# Altium schematic sheet Offset.SchDoc
size A4; SheetNumber: 5; SheetTotal: 7
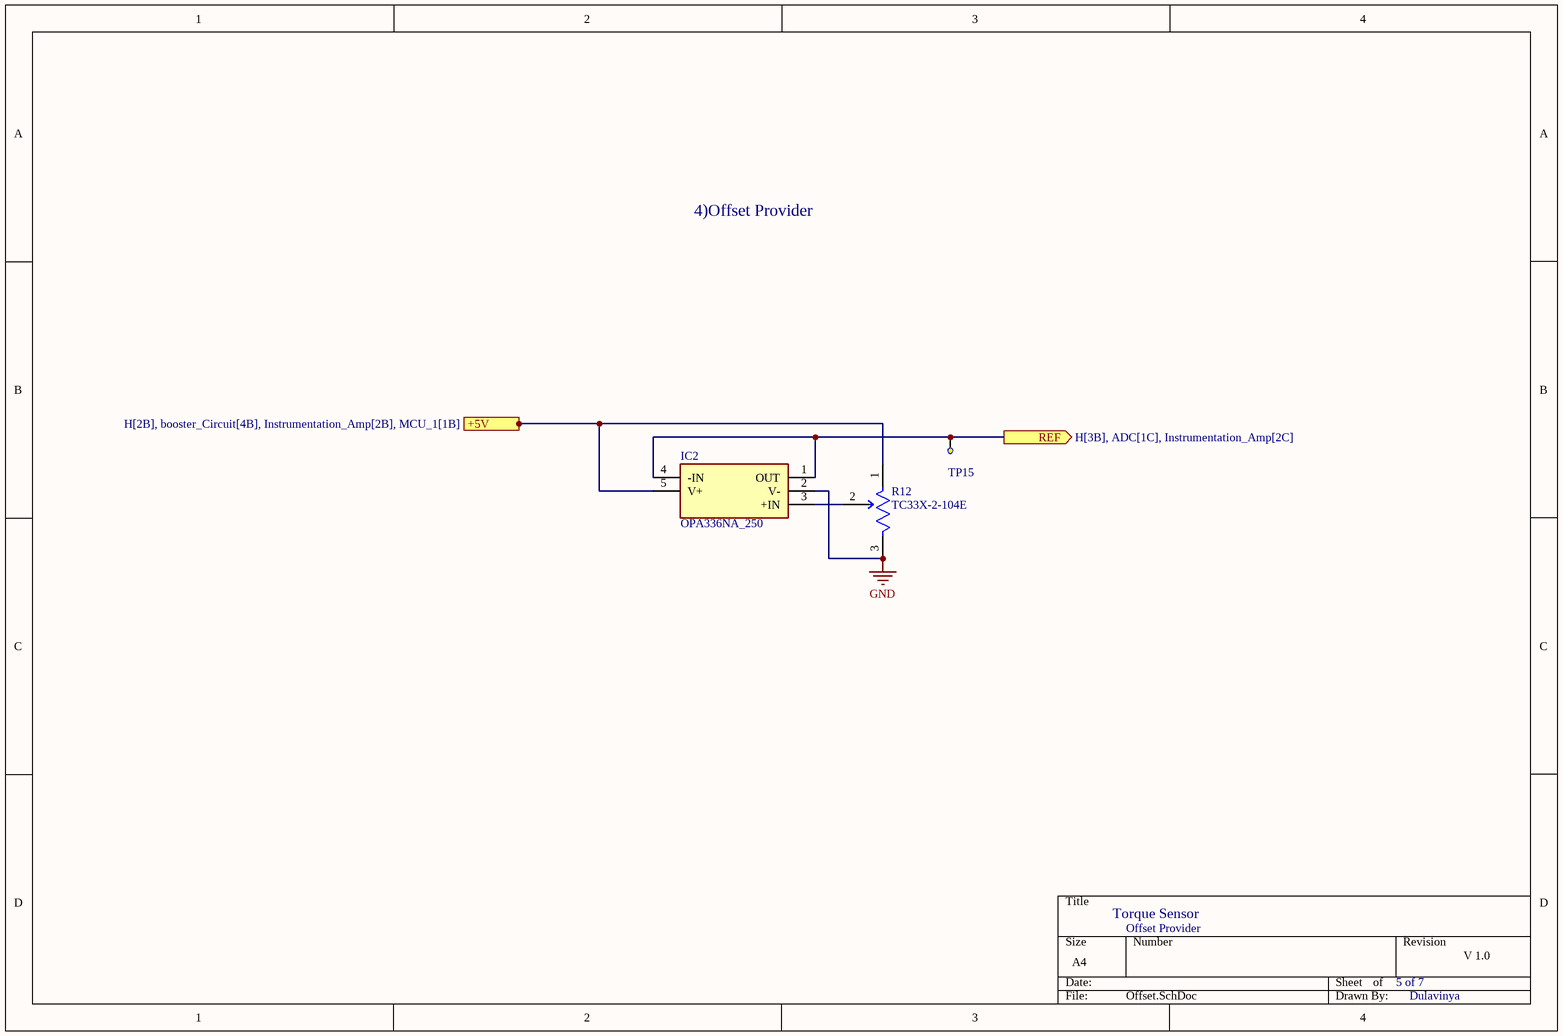
[diagram p0: Offset.SchDoc]

## Parts
IC2  OPA336NA_250  [SOT95P280X145-5N]
R12  TC33X-2-104E  [FP-TC33X-2-MFG]
TP15  Test point  [Test_point]  (value not drawn)

## Ports
+5V (in, see H[2B], booster_Circuit[4B], Instrumentation_Amp[2B], MCU_1[1B]), REF (out, see H[3B], ADC[1C], Instrumentation_Amp[2C])

## Nets
GND: IC2.2(V-) R12.3(CW)
+5V: IC2.5(V+) R12.1(CCW) ; port +5V
REF: IC2.1(OUT) IC2.4(-IN) TP15.TP?(Test_point) ; port REF
NetIC2_3: IC2.3(+IN) R12.2(WIPER)

## Notes on the sheet
- 4)Offset Provider
- Torque Sensor
- Offset Provider
- 5 of 7
- V 1.0
- Dulavinya

## Library data of the parts
IC2 = OPA336NA_250: Integrated Circuit; Manufacturer_Name: Texas Instruments; Manufacturer_Part_Number: OPA336NA/250; Datasheet Link: https://datasheet.datasheetarchive.com/originals/distributors/Datasheets-SFU2/DSASFU100026219.pdf; Height: 1.45mm; Mouser Part Number: 595-OPA336NA/250; Mouser Price/Stock: https://www.mouser.co.uk/ProductDetail/Texas-Instruments/OPA336NA-250?qs=7nS3%252BbEUL6tQBFLtH5Jvdg%3D%3D; Arrow Part Number: OPA336NA/250; Arrow Price/Stock: https://www.arrow.com/en/products/opa336na250/texas-instruments?utm_currency=USD&region=nac
R12 = CMP-07234-000040-1: TRIMMER 100K OHM 0.1W J LEAD TOP; Number of Turns: 1; Voltage Rating (DC): 50V; Power Rating: 100mW; Resistance Tolerance: 25%; Resistance: 100kR; Temperature Coefficient: 250ppm/°C; Max Operating Temperature: 100°C; Package Quantity: 2500; REACH SVHC: No SVHC; Termination: Foot Print; Packaging: Tape and Reel; RoHS Compliant: Yes; Military Standard: Not; Color: Silver; Width: 0.118inch; Min Operating Temperature: -40°C; Mount: Surface Mount; Height: 0.047inch; Tolerance: 25%; Resistor Type: Carbon; Length: 3mm; Depth: 3.8mm; Weight: 29.4mg; Max Power Dissipation: 100mW; Series: TC33; Radiation Hardening: No
TP15 = test_point: Value: Test point